# EasyEDA schematic Pressure Rig_2020-12-04_14-32-13.json
TITLE: Sheet_1; REV: 1.0; Date: 2020-12-02; Sheet: 1/1; Drawn By: Ellie Zhou; Company: Your Company
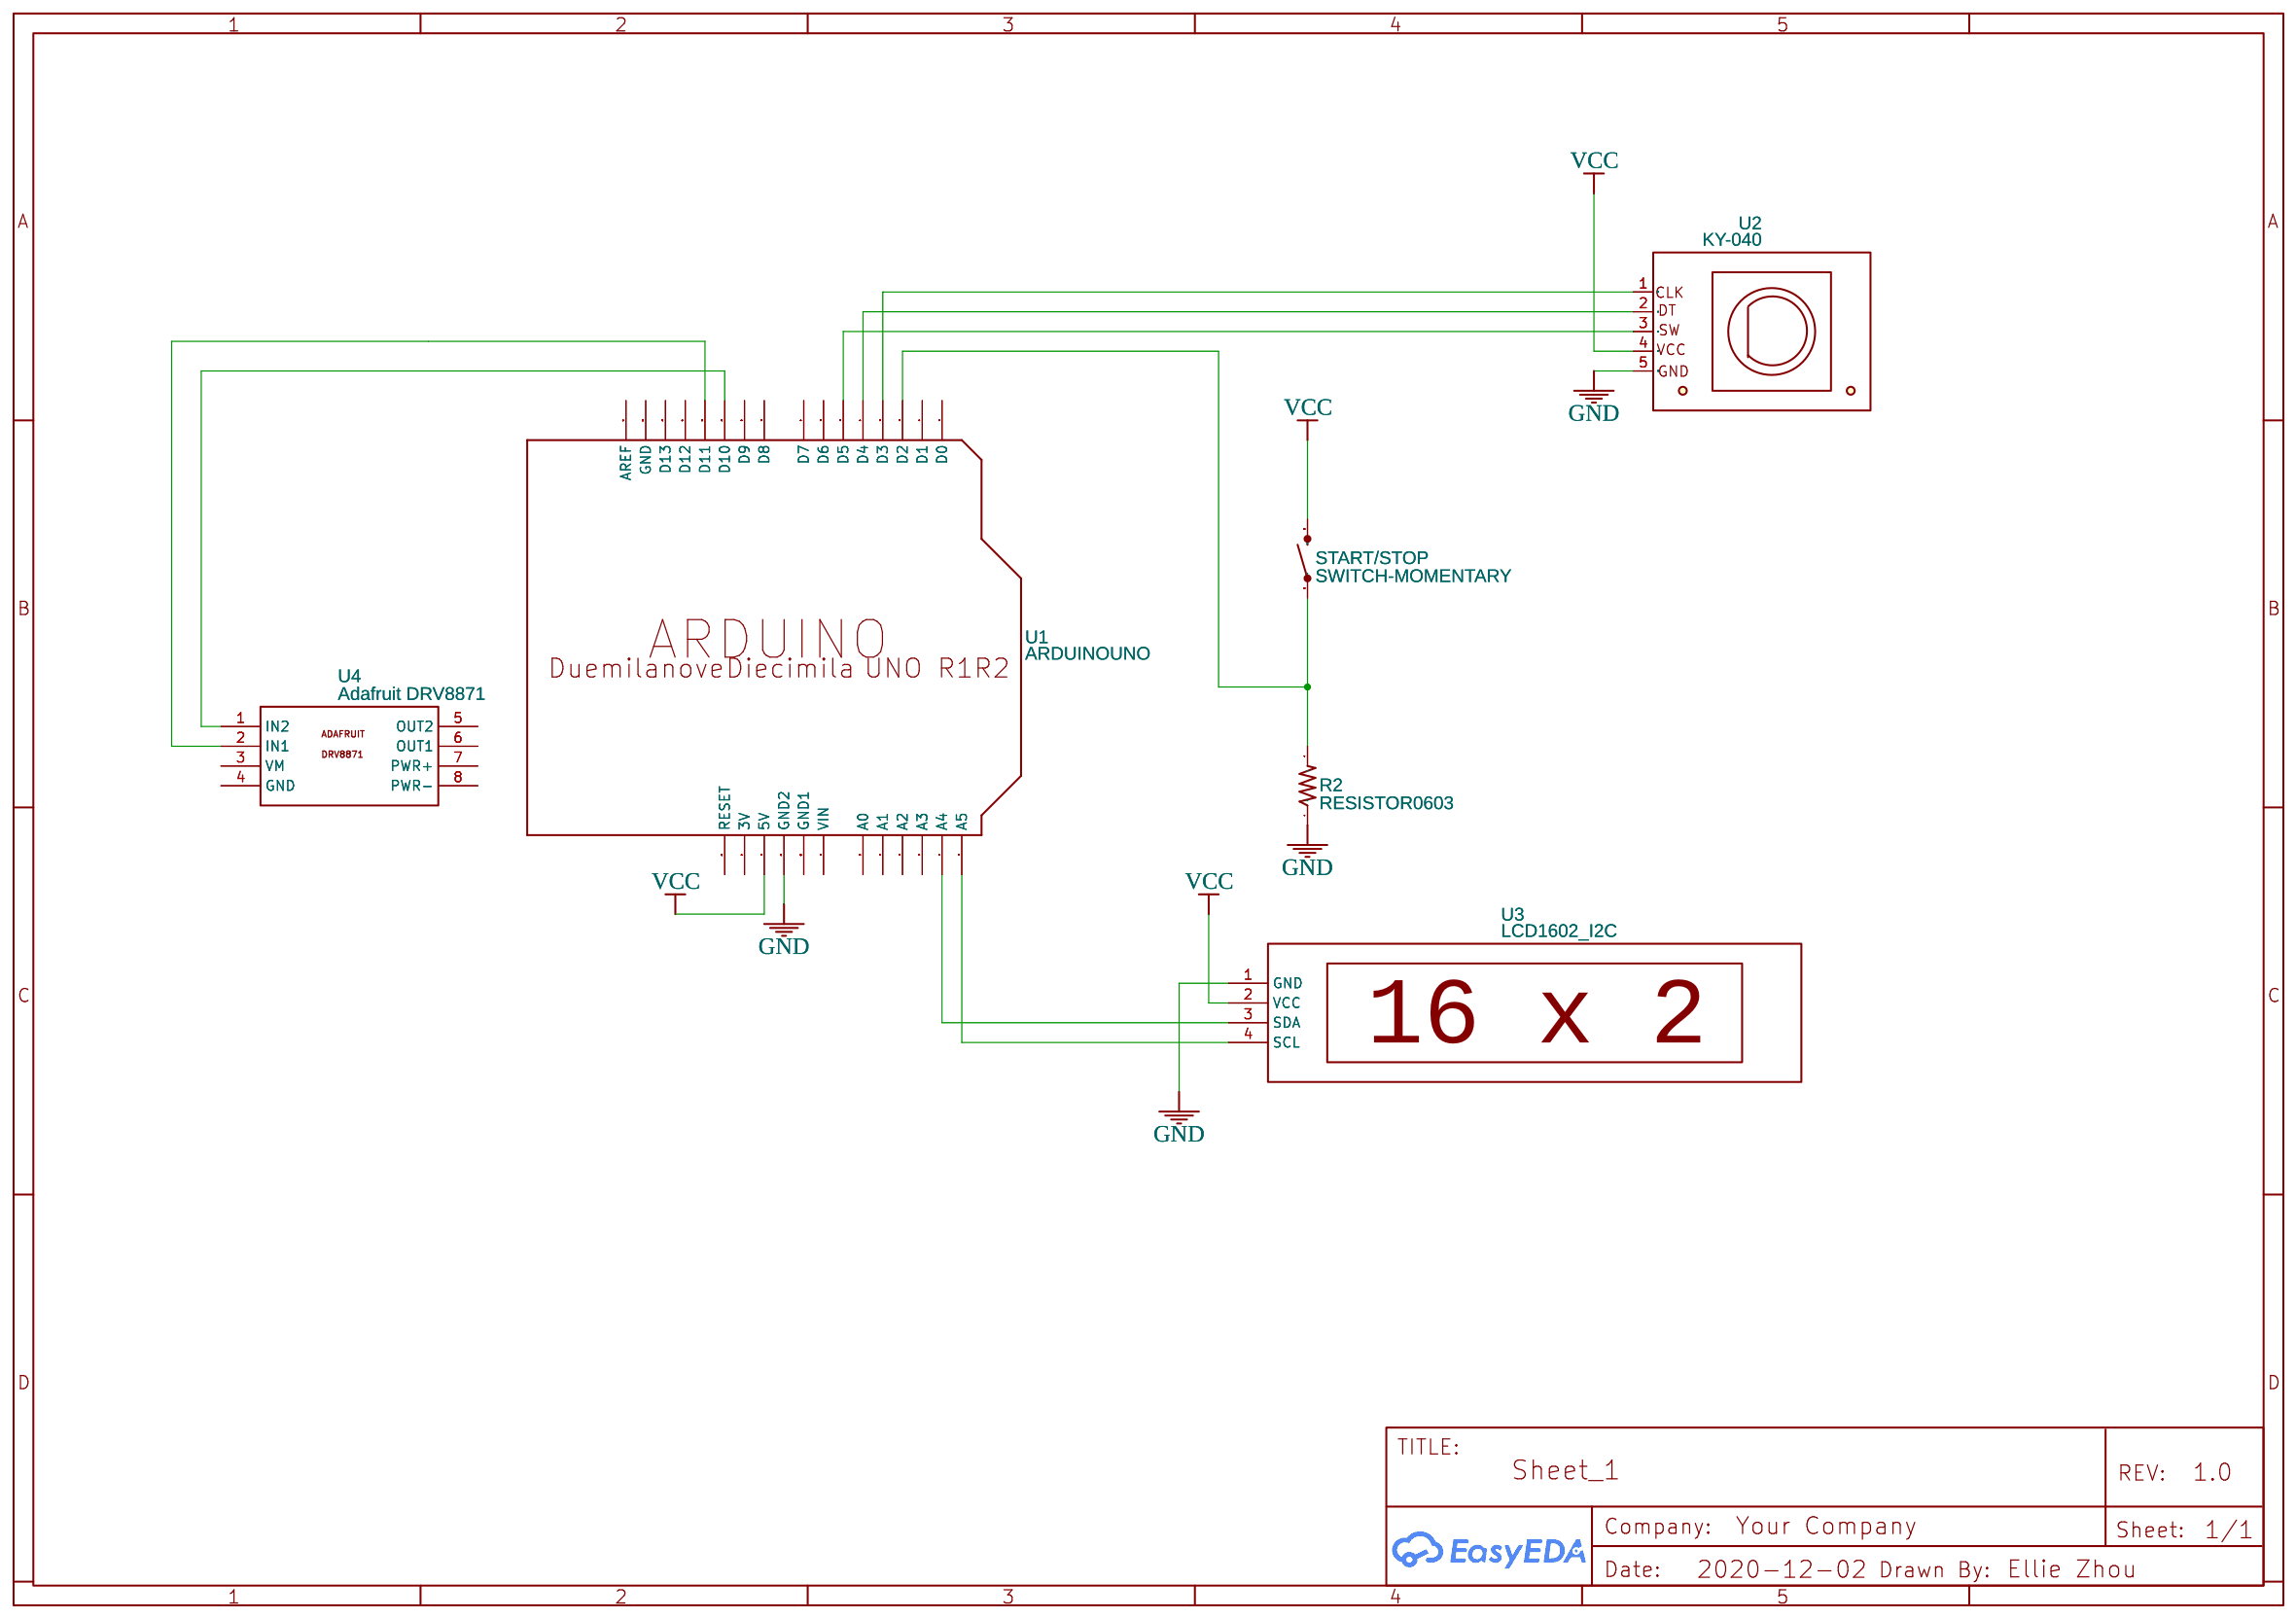
[diagram p0: schematic sheet]

## Parts
R2  RESISTOR0603  [0603-RES]
START/STOP  SWITCH-MOMENTARY  [SWITCH-RIGHT-ANGLE]
U1  ARDUINOUNO  [ARDUINO]
U2  KY-040  [ENCODER_ROTARY_POT_KY-040_SPODNI]
U3  LCD1602_I2C  [LCD-1602 ONLY I2C HOLE_V2]
U4  Adafruit DRV8871  [ADAFRUIT DRV8871]

## Library data of the parts
R2 = RESISTOR0603: Resistor; Contributor: SparkFun
START/STOP = SWITCH-MOMENTARY: Contributor: Pinoccio
U1 = ARDUINOUNO: Arduino DiecimilaDuemilanove; Contributor: Adafruit
U2 = KY-040: Contributor: elmiko
U3 = LCD1602_I2C: Manufacturer Part: LCD1602 I2C; Contributor: Primesty
U4 = Adafruit DRV8871: Manufacturer: Adafruit; Manufacturer Part: 3190; Supplier Part: 1528-1719-ND; Supplier: Digi-Key; Contributor: foxtechnica; Supplier 2: Mouser; Supplier 2 Part: 485-3190

## Nets
GND: R2.1 U1.GND2 U2.5(GND) U3.1(GND)
VCC: START/STOP.P$2(2) U1.5V U2.4(VCC) U3.2(VCC)
Net-(R2-2): R2.2 START/STOP.P$1(1) U1.D2
Net-(U1-A4): U1.A4 U3.3(SDA)
Net-(U1-A5): U1.A5 U3.4(SCL)
Net-(U1-D3): U1.D3 U2.1(CLK)
Net-(U1-D4): U1.D4 U2.2(DT)
Net-(U1-D5): U1.D5 U2.3(SW)
Net-(U1-D10): U1.D10 U4.1(IN2)
Net-(U1-D11): U1.D11 U4.2(IN1)

Not connected (* = marked no-connect by the designer): U1 3V A0 A1 A2 A3 AREF D0 D1 D6 D7 D8 D9 D12 D13 GND GND1 RESET VIN; U4 3(VM) 4(GND) 5(OUT2) 6(OUT1) 7(PWR+) 8(PWR-)
